# EAGLE design N2-D (EAGLE 7.6.0)
COMPANY: ADAFRUIT INDUSTRIES; DRAWN: KTOWN; REV: B
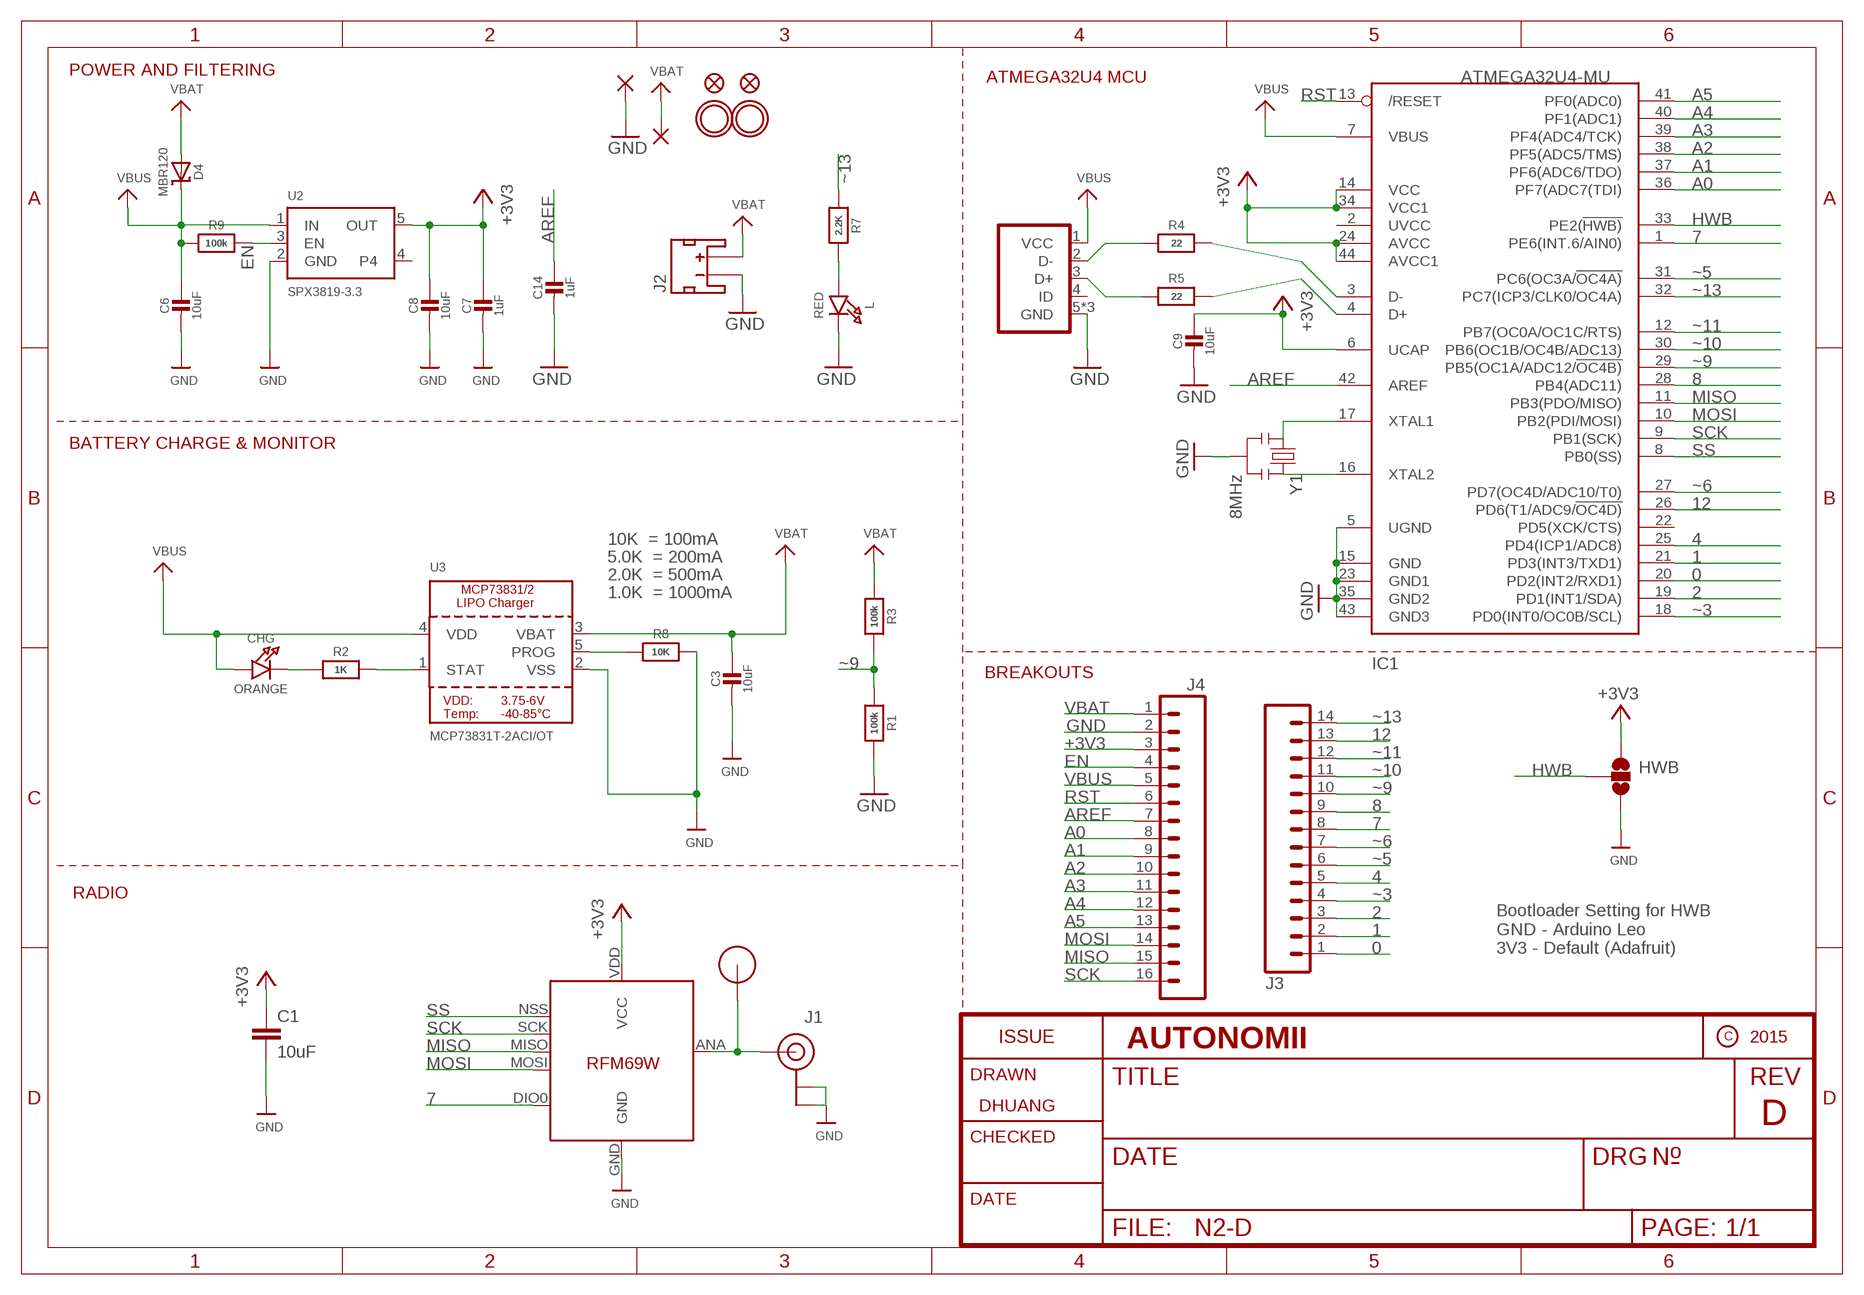
[diagram p0: schematic, sheet 1]
FRAME1 (FRAME_A4): COMPANY: AUTONOMII; DRAWN: DHUANG; REV: D

## Parts
C1  10uF  CAP0603-CAP  [0603-CAP]
C3  10uF  CAP_CERAMIC0805-NOOUTLINE  [0805-NO]
C6  10uF  CAP_CERAMIC0805-NOOUTLINE  [0805-NO]
C7  1uF  CAP_CERAMIC0603_NO  [0603-NO]
C8  10uF  CAP_CERAMIC0805-NOOUTLINE  [0805-NO]
C9  10uF  CAP_CERAMIC0805-NOOUTLINE  [0805-NO]
C14  1uF  CAP_CERAMIC0603_NO  [0603-NO]
CHG  ORANGE  LED0805_NOOUTLINE  [CHIPLED_0805_NOOUTLINE]
D4  MBR120  DIODE-SCHOTTKYSOD-123  [SOD-123]
HWB  SOLDERJUMPER_2WAYPASTE1&2  [SJ_3_PASTE1&2]
IC1  ATMEGA32U4-MU  [TQFN44_7MM]
J1  U.FL  [U.FL]
J2  JST_2MM_MALE  [JST-2-SMD]
J3  M14STACKING_BIG  [1X14_STACKING_BIG]
J4  M16STACKING_BIG  [1X16_STACKING_BIG]
L  RED  LED0805_NOOUTLINE  [CHIPLED_0805_NOOUTLINE]
PAD1  1,6/0,9  [1,6/0,9]
PAD2  1,6/0,9  [1,6/0,9]
R1  100k  RESISTOR_0603_NOOUT  [0603-NO]
R2  1K  RESISTOR_0603_NOOUT  [0603-NO]
R3  100k  RESISTOR_0603_NOOUT  [0603-NO]
R4  22  RESISTOR_0603_NOOUT  [0603-NO]
R5  22  RESISTOR_0603_NOOUT  [0603-NO]
R7  2.2K  RESISTOR_0603_NOOUT  [0603-NO]
R8  10K  RESISTOR_0603_NOOUT  [0603-NO]
R9  100k  RESISTOR_0603_NOOUT  [0603-NO]
U2  SPX3819-3.3  VREG_SOT23-5  [SOT23-5]
U3  MCP73831T-2ACI/OT  MCP73831/2  [SOT23-5]
U$7  RFM12B_ANTENNA  [RFM12B-ANTENNA]
U$10  RFM69  [RFM69W-MINPADS]
U$31  MOUNTINGHOLE2.5  [MOUNTINGHOLE_2.5_PLATED]
U$32  MOUNTINGHOLE2.5  [MOUNTINGHOLE_2.5_PLATED]
U$34  FIDUCIAL""  [FIDUCIAL_1MM]
U$35  FIDUCIAL""  [FIDUCIAL_1MM]
USB  USB-RECEPTABLE  [FCI-10103594-0001LF]
Y1  8MHz  RESONATORSMD  [RESONATOR-SMD]

## Nets
0: IC1.20(PD2(INT2/RXD1)) J3.1
1: IC1.21(PD3(INT3/TXD1)) J3.2
2: IC1.19(PD1(INT1/SDA)) J3.3
4: IC1.25(PD4(ICP1/ADC8)) J3.5
7: IC1.1(PE6(INT.6/AIN0)) J3.8 U$10.DIO0
8: IC1.28(PB4(ADC11)) J3.9
12: IC1.26(PD6(T1/ADC9/!OC4D)) J3.13
+3V3: C1.1 C7.1 C8.1 C9.1 HWB.1 IC1.6(UCAP) IC1.14(VCC) IC1.24(AVCC) IC1.34(VCC1) IC1.44(AVCC1) J4.3 U2.5(OUT) U$10.VDD(VCC)
A0: IC1.36(PF7(ADC7(TDI)) J4.8
A1: IC1.37(PF6(ADC6/TDO)) J4.9
A2: IC1.38(PF5(ADC5/TMS)) J4.10
A3: IC1.39(PF4(ADC4/TCK)) J4.11
A4: IC1.40(PF1(ADC1)) J4.12
A5: IC1.41(PF0(ADC0)) J4.13
ANT: J1.P$3(SIGNAL) U$7.P$1 U$10.ANA(ANT)
AREF: C14.1 IC1.42(AREF) J4.7
D+: IC1.4(D+) R5.2
D++: R5.1 USB.3(D+)
D-: IC1.3(D-) R4.2
D--: R4.1 USB.2(D-)
EN: J4.4 R9.2 U2.3(EN)
GND: C1.2 C3.2 C6.2 C7.2 C8.2 C9.2 C14.2 HWB.3 IC1.5(UGND) IC1.15(GND) IC1.23(GND1) IC1.35(GND2) IC1.43(GND3) J1.P$1(GND) J1.P$2(GND) J2.1(-) J4.2 L.C PAD2.1(P) R1.2 R8.2 U2.2(GND) U3.2(VSS) U$10.GND USB.5(GND) USB.P$3(GND) USB.P$4(GND) Y1.2
HWB: HWB.2 IC1.33(PE2(!HWB))
MISO: IC1.11(PB3(PDO/MISO)) J4.15 U$10.MISO
MOSI: IC1.10(PB2(PDI/MOSI)) J4.14 U$10.MOSI
N$1: CHG.C R2.1
N$2: L.A R7.2
N$3: R2.2 U3.1(STAT)
N$4: R8.1 U3.5(PROG)
N$11: IC1.16(XTAL2) Y1.3
N$12: IC1.17(XTAL1) Y1.1
RST: IC1.13(/RESET) J4.6
SCK: IC1.9(PB1(SCK)) J4.16 U$10.SCK
SS: IC1.8(PB0(SS)) U$10.NSS(SEL)
VBAT: C3.1 D4.A J2.2(+) J4.1 PAD1.1(P) R3.1 U3.3(VBAT)
VBUS: C6.1 CHG.A D4.C IC1.7(VBUS) J4.5 R9.1 U2.1(IN) U3.4(VDD) USB.1(VCC)
~3: IC1.18(PD0(INT0/OC0B/SCL)) J3.4
~5: IC1.31(PC6(OC3A/!OC4A)) J3.6
~6: IC1.27(PD7(OC4D/ADC10/T0)) J3.7
~9: IC1.29(PB5(OC1A/ADC12/!OC4B)) J3.10 R1.1 R3.2
~10: IC1.30(PB6(OC1B/OC4B/ADC13)) J3.11
~11: IC1.12(PB7(OC0A/OC1C/RTS)) J3.12
~13: IC1.32(PC7(ICP3/CLK0/OC4A)) J3.14 R7.1
Unconnected: IC1.2(UVCC) IC1.22(PD5(XCK/CTS)) J2.NC1(PAD1) J2.NC2(PAD2) U2.4 USB.4(ID)

## Notes on the sheet
- POWER AND FILTERING
- ATMEGA32U4 MCU
- BATTERY CHARGE & MONITOR
- 10K  = 100mA
- 5.0K  = 200mA
- 2.0K  = 500mA
- 1.0K  = 1000mA
- BREAKOUTS
- RADIO
- Bootloader Setting for HWB
  GND - Arduino Leo
  3V3 - Default (Adafruit)

## Library data of the parts
C1 = autonomii:CAP: Capacitor Standard 0603 ceramic capacitor, and 0.1" leaded capacitor.
C3 C6-C9 C14 = microbuilder:CAP_CERAMIC: Ceramic Capacitors For new designs, use the packages preceded by an '_' character since they are more reliable: The following footprints should be used on most boards: _0402 - Standard footprint for regular board layouts _0603 - Standard footprint for regular board layouts _0805 - Standard footprint for regular board layouts _1206 - Standard footprint for regular board layouts For extremely tight-pitch boards where space is at a premium, the following 'micro-pitch' footprints can be used (smaller pads, no silkscreen outline, etc.): _0402MP - Micro-pitch footprint for very dense/compact boards _0603MP - Micro-pitch footprint for very dense/compact boards _0805MP - Micro-pitch footprint for very dense/compact boards _1206MP - Micro-pitch footprint for very dense/compact boards
CHG L = microbuilder:LED: LED 0603 - 0603 Surface Mount Package 2mA: Green LED - Low Power (3.9mcd, 2ma, 1.7Vf) - Digikey: 475-2709-2-ND Orange LED - Low Power (9.8mcd, 2ma, 1.8Vf) - Digikey: 475-1194-2-ND Red LED - Low Power (5mcd, 2ma, 1.8Vf) - Digikey: 475-1195-2-ND Yellow LED - Low Power (7mcd, 2ma, 1.8Vf) - Digikey: 475-1196-2-ND 5mA: Blue LED - Low Power (17mcd, 5ma, 2.9Vf) - Digikey: LNJ937W8CRACT-ND 0805 - 0805 Surface Mount Package 2mA: Red LED (8.8mcd, 2mA, 1.8Vf, Clear) - Low Power [Digikey: 475-2510-1-ND] Green LED (5mcd, 2mA, 1.8Vf, Clear) - Low Power [Digikey: 475-2730-1-ND] Yellow LED (11.3mcd, 2mA, 1.8Vf, Clear) - Low Power [Digikey: 475-2555-1-ND] 20mA: Red LED (104mcd, 20mA, Diffused) - LS R976 [Digikey: 475-1278-6-ND] Red LED (12mcd, 20mA, 2.0Vf, Clear) - APT2012EC [Digikey: 754-1128-1-ND] Green LED (15mcd, 20mA, 2.2Vf, Clear) - APT2012GC [Digikey: 754-1131-1-ND] Orange LED (160mcd, 20mA, 2.1Vf, Clear) - APT2012SECK [Digikey: 754-1130-1-ND] 1206 - 1206 Surface Mount Package Green LED (26mcd, 20mA, Diffused) - LG N971 [Digikey: 475-1407-6-ND] Red LED (15mcd, 20mA, Diffused) - LH N974 [Digikey: 475-1416-6-ND] Cree - Cree High-Power Surface Mount LEDs XPEBWT-L1-0000-00D50 - White 111lm 350mA 2.9Vf 6200K 110° XTEAWT-00-0000-00000LEE3 - White 114lm 350mA 2.85Vf 5000K 115° Everlight - Everlight 45-21 Series Surface Mount LEDs 45-21/QK2C-B2832AC2CB2/2T - Warm White 2000mcd 20mA 3.25Vf 3050K 120° 45-21/LK2C-B38452C4CB2/2T - Nuetral White 2000mcd 20mA 3.25Vf 4150K 120° 45-21/LK2C-B50634C6CB2/2T - Cold White 2200mcd 20mA 3.25Vf 5650K 120° PLCC2 Reverse Mount LS T77K-J1L2-1-0-2-R18-Z - Red 11.25mcd 2mA 1.8Vf 630nm 120° LO T77K-L1M2-24-Z - Orange 19.6mcd 2mA 1.8Vf 606nm 120° LY T77K-K2M1-26-Z - Yellow 15.7mcd 2mA 1.8Vf 587nm 120°
D4 = microbuilder:DIODE-SCHOTTKY
HWB = autonomii:SOLDERJUMPER_2WAY: Solder Jumper 2 way solder jumper
IC1 = microbuilder:ATMEGA32U4: http://www.ladyada.net/library/eagle
J1 = SparkFun-Connectors:U.FL: SMD antenna connector- WRL-09144; PROD_ID: CONN-09193
J2 = autonomii:JST_2MM_MALE: Mates to single-cell LiPo batteries. CONN-08352; PROD_ID: CONN-08352
J3 = autonomii:M14: Header 14 Standard 14-pin 0.1" header. Use with straight break away headers (SKU : PRT-00116), right angle break away headers (PRT-00553), swiss pins (PRT-00743), machine pins (PRT-00117), and female headers (PRT-00115).
J4 = autonomii:M16: 1x16 .1" header
PAD1 PAD2 = wirepad:1,6/0,9: THROUGH-HOLE PAD
R1-R5 R7-R9 = microbuilder:RESISTOR: Resistors For new designs, use the packages preceded by an '_' character since they are more reliable: The following footprints should be used on most boards: _0402 - Standard footprint for regular board layouts _0603 - Standard footprint for regular board layouts _0805 - Standard footprint for regular board layouts _1206 - Standard footprint for regular board layouts For extremely tight-pitch boards where space is at a premium, the following 'micro-pitch' footprints can be used (smaller pads, no silkscreen outline, etc.): _0402MP - Micro-pitch footprint for very dense/compact boards _0603MP - Micro-pitch footprint for very dense/compact boards _0805MP - Micro-pitch footprint for very dense/compact boards _1206MP - Micro-pitch footprint for very dense/compact boards
U2 = microbuilder:VREG_SOT23-5: SOT23-5 Fixed Voltage Regulators Part Current Out V Out V In V Dropout θJA (°C/W) TJ (°C) Digikey Part No. ADP121 150mA 3.3V 3.4-5.5V 0.09V @ 150mA -- -- ADP121-AUJZ33R7CT-ND ADP121 150mA 3.0V 3.1-5.5V 0.09V @ 150mA -- -- ADP121-AUJZ30R7CT-ND ADP122 300mA 3.3V 3.4-5.5V 0.085V @ 300mA -- -- ADP122AUJZ-3.3-R7CT-ND ADP1712 300mA 3.3V 3.5-5.5V 0.17V @ 300mA -- -- ADP1712AUJZ-3.3-R7TR-ND AP7311 (Low Cost) 150mA 3.3V 3.5-6V 0.15V @ 150mA -- -- AP7311-33WG-7DICT-ND LD39015M18R 150mA 1.8V 1.9V-5.5V 0.08V @ 100mA -- -- 497-6977-1-ND LP2985A-33DBVR 150mA 3.3V 3.3-16V 0.28V @ 150mA 206 150 296-18479-1-ND MCP1824T-3302E/OT 300mA 3.3V 3.5V-6V 0.2V @ 300mA -- -- MCP1824T-3302E/OTCT-ND MIC5205-2.5YM5 TR 150mA 2.5V 2.7-16V 0.165V @ 150mA -- -- 576-1257-2-ND MIC5205-3.0YM5 TR 150mA 3.0V 3.2V-16V 0.165V @ 150mA -- -- 576-1258-2-ND MIC5205-3.3YM5 TR 150mA 3.3V 3.5V-16V 0.165V @ 150mA -- -- 576-1259-2-ND TPS780330220 150mA 3.3V+2.2V 3.6-5.5V 250mV Max -- -- 296-23332-1-ND TDA3663/N1,135 100mA 3.3V 3.5-45V 0.18V @ 50mA -- -- 568-5343-1-ND Max operating temp can be calculated using θJA, TJ (max junction temperature), and power in watts. Set the "Maximum Ambient Temperature" until it reaches TJ ("Max Junction Temperature"), which is the absolute limit for safe use of the regulator: Heat Sink Temperature Calculator <http://www.daycounter.com/Calculators/Heat-Sink-Temperature-Calculator.phtml> For example, With 12V source into a 3.3V LP2985 and a 30mA load, we are dissipating (12V-3.3V) * 0.03A = 0.261W. With a θJA of 206 °C/W, a TJ of 150°C, and 261mW we can safely use the chip without a heat sink up to 75°C (=147.1°C Junction Temperature).
U3 = microbuilder:MCP73831/2: MCP73831/2 LIPO Charger VDD: 3.75 - 6V Temp -40 - 85°C Programmable Charge Rate: 15-500mA NOTE: STAT is a tri-state logic output on the MCP73831 and an open-drain output on the MCP73832. SOT23-5 with 4.2V output and tri-state logic on STAT = MCP73831T-2ACI/OT
U$7 = LowPowerLab:RFM12B_ANTENNA
U$10 = LowPowerLab:RFM69
U$31 U$32 = microbuilder:MOUNTINGHOLE: Mounting Hole For #2 screws (0.086"/2.18mm width, 0.094"/2.4mm hole) use 2.5mm; BOM: EXCLUDE
U$34 U$35 = microbuilder:FIDUCIAL: Fiducial Alignment Points Various fiducial points for machine vision alignment.; BOM: EXCLUDE
USB = autonomii:USB-RECEPTABLE: USB Receptable
Y1 = SparkFun:RESONATOR: Resonator Small SMD resonator. This is the itty bitty 10/20MHz resonators with built in caps. CSTCE10M0G55 and CSTCE20M0V53. Footprint has been reviewed closely but hasn't been tested yet.

## Net classes
1 power: width 0.381 mm, clearance 0.254 mm

## Board
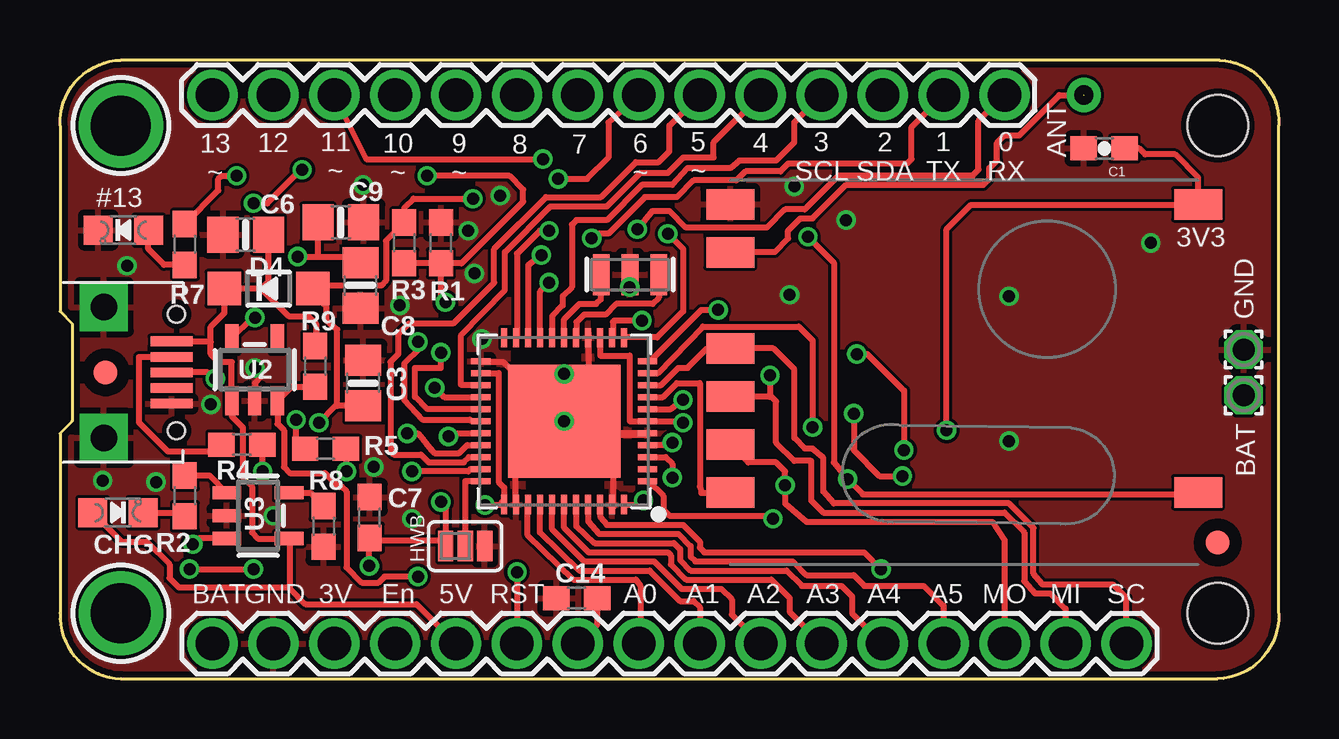
[diagram p1: board, top side]
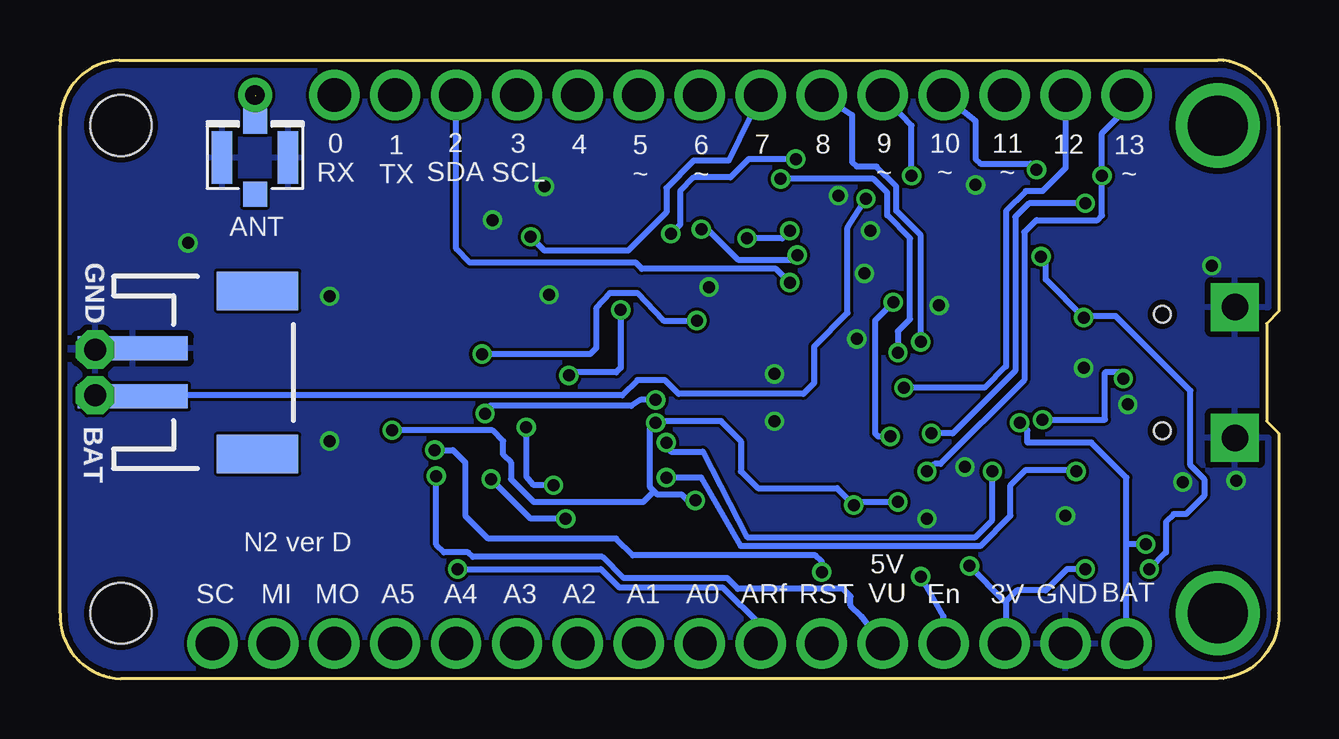
[diagram p2: board, bottom side, seen from below]

Size 50.8 x 25.78 mm. Coordinates in mm from the lower left corner, seen from the top.
Outline: 2.54,0 48.26,0 arc90 50.8,2.73 50.8,23.05 arc90 48.32,25.78 2.54,25.78 arc90 0,23.05 0,15.3 0.51,14.8 0.51,10.73 0,10.22 0,2.73 arc90 2.54,0
Copper layers (1*16): Top 0.035mm / dielectric 1.5mm / Bottom 0.035mm
Design rules "dirt_cheap_dirty_boards.v1": minimum track width 5mil, minimum drill 12mil, track to track 5mil, track to pad 5mil, pad to pad 5mil, via to via 5mil, smd to smd 0mil, copper to edge 10mil, drill to drill 10mil, minimum pad ring 10mil, minimum via ring 6mil, stop-mask expansion 2mil, vias tented up to drill 25mil, thermal gap 10mil
Holes 2.54 mm at 48.26,23.05 48.26,2.73
tRestrict: area 19.4,7.8 to 22.7,8.2; area 18.8,13.3 to 21.7,13.7; area 23.5,8.1 to 23.9,10

### Footprints (pad centres in the part's own frame; a part is rotated, then mirrored left to right if it is on the bottom)
0603-CAP = smd 1.1 x 1: 1 -0.85,0; 2 0.85,0
0805-NO = smd 1.3 x 1.5: 1 -0.95,0; 2 0.95,0
0603-NO = smd 1.1 x 1: 1 -0.85,0; 2 0.85,0
CHIPLED_0805_NOOUTLINE = smd 1.2 x 1.2: A 0,-1.05; C 0,1.05
SOD-123 = smd 1.4 x 1.4: A 1.85,0; C -1.85,0
SJ_3_PASTE1&2 = smd 0.635 x 1.27: 1 -0.813,0; 2 0,0; 3 0.813,0
TQFN44_7MM = smd 0.25 x 0.8: 1 -2.5,-3.475; 2 -2,-3.475; 3 -1.5,-3.475; 4 -1,-3.475; 5 -0.5,-3.475; 6 0,-3.475; 7 0.5,-3.475; 8 1,-3.475; 9 1.5,-3.475; 10 2,-3.475; 11 2.5,-3.475; 23 2.5,3.475; 24 2,3.475; 25 1.5,3.475; 26 1,3.475; 27 0.5,3.475; 28 0,3.475; 29 -0.5,3.475; 30 -1,3.475; 31 -1.5,3.475; 32 -2,3.475; 33 -2.5,3.475 | smd 0.8 x 0.25: 12 3.475,-2.5; 13 3.475,-2; 14 3.475,-1.5; 15 3.475,-1; 16 3.475,-0.5; 17 3.475,0; 18 3.475,0.5; 19 3.475,1; 20 3.475,1.5; 21 3.475,2; 22 3.475,2.5; 34 -3.475,2.5; 35 -3.475,2; 36 -3.475,1.5; 37 -3.475,1; 38 -3.475,0.5; 39 -3.475,0; 40 -3.475,-0.5; 41 -3.475,-1; 42 -3.475,-1.5; 43 -3.475,-2; 44 -3.475,-2.5 | smd 4.7 x 4.7: THERMAL 0,0
U.FL = smd 2.2 x 0.85: P$1 0,1.375; P$2 0,-1.375 | smd 1.05 x 1: P$3 1.525,0; P$4 -1.525,0
JST-2-SMD = smd 1 x 4.6: 1 -1,-3.7; 2 1,-3.7 | smd 1.6 x 3.4: NC1 -3.4,1.5; NC2 3.4,1.5
1X14_STACKING_BIG = drill 1.4 pad 1.88: 1 -16.51,0; 2 -13.97,0; 3 -11.43,0; 4 -8.89,0; 5 -6.35,0; 6 -3.81,0; 7 -1.27,0; 8 1.27,0; 9 3.81,0; 10 6.35,0; 11 8.89,0; 12 11.43,0; 13 13.97,0; 14 16.51,0
1X16_STACKING_BIG = drill 1.4 pad 1.88: 1 -19.05,0; 2 -16.51,0; 3 -13.97,0; 4 -11.43,0; 5 -8.89,0; 6 -6.35,0; 7 -3.81,0; 8 -1.27,0; 9 1.27,0; 10 3.81,0; 11 6.35,0; 12 8.89,0; 13 11.43,0; 14 13.97,0; 15 16.51,0; 16 19.05,0
1,6/0,9 = drill 0.914 pad 1.6 octagon: 1 0,0
SOT23-5 = smd 0.55 x 1.2: 1 -0.95,-1.3; 2 0,-1.3; 3 0.95,-1.3; 4 0.95,1.3; 5 -0.95,1.3
RFM12B-ANTENNA = drill 0.8 pad 1.422: P$1 0,0
RFM69W-MINPADS = smd 2 x 1.27: ANA 8,-5; DIO0 -11.5,5; GND 8,-7; MISO 8,1; MOSI 8,3; NSS 8,5; SCK 8,-1; VDD -11.5,-7
MOUNTINGHOLE_2.5_PLATED = drill 2.5 pad 3.2: P$1 0,0
FIDUCIAL_1MM = smd 1 x 1: 1 0,0
FCI-10103594-0001LF = smd 0.4 x 1.75: 1 -1.3,4.525; 2 -0.65,4.525; 3 0,4.525; 4 0.65,4.525; 5 1.3,4.525 | drill 1.1 pad 2 square: P$3 -2.725,1.7; P$4 2.725,1.7 | hole 0.7: -2.425,4.73; 2.425,4.73
RESONATOR-SMD = smd 0.7 x 1.7: 1 -1.2,0; 2 0,0; 3 1.2,0

### Placement (x,y rotation side)
C1  43.52,22.1 180 top
C3  12.64,12.32 90 top
C6  7.74,18.5 180 top
C7  12.91,6.72 90 top
C8  12.52,16.39 270 top
C9  11.71,19.02 0 top
C14  21.54,3.36 180 top
CHG  2.41,6.92 270 top
D4  8.7,16.26 0 top
HWB  16.89,5.52 0 top
IC1  21.02,10.73 90 top
J1  42.67,21.72 90 bottom
J2  44.07,12.76 270 bottom
J3  22.86,24.32 180 top
J4  25.4,1.46 0 top
L  2.65,18.69 90 top
PAD1  49.34,11.81 0 top
PAD2  49.34,13.72 270 top
R1  15.88,18.16 90 top
R2  5.21,7.62 90 top
R3  14.35,18.16 270 top
R4  7.58,9.76 0 top
R5  11.07,9.58 0 top
R7  5.21,18.1 270 top
R8  10.99,6.35 270 top
R9  10.64,13.02 270 top
U2  8.12,12.88 0 top
U3  8.26,6.79 270 top
U$7  42.67,24.32 0 top
U$10  35.94,12.76 180 top
U$31  2.54,23.05 270 top
U$32  2.54,2.73 270 top
U$34  1.91,12.76 270 top
U$35  48.26,5.68 270 top
USB  0.13,12.76 270 top
Y1  23.76,16.84 0 top

### Tracks (layer width: path | path; a pad name or v marks a point on that pad's centre or on a via)
0  (via drill 0.5)
  Top 0.254: v24.07,18.73 24.7,19.49 25.4,19.49 26.1,18.8 29.46,18.8 30.23,19.56 31.05,19.56 32.45,20.96 38.04,20.96 38.29,21.21 38.29,23.24 J3.1 | v20.07,17.65 19.52,17.23 IC1.20
  Bottom 0.254: v24.07,18.73 23.81,18.73 22.54,17.46 20.26,17.46 v20.07,17.65
1  (via drill 0.5)
  Top 0.254: v22.16,18.35 22.35,18.54 22.86,18.54 24.38,20.07 25.72,20.07 26.42,20.76 28.19,20.76 28.57,21.15 30.04,21.15 30.35,21.46 35.31,21.46 35.5,21.65 35.5,22.99 J3.2 | IC1.21 19.05,14.24 19.05,17.72 20,18.67 v20.38,18.67
  Bottom 0.254: v20.38,18.67 20.7,18.35 v22.16,18.35
2  (via drill 0.5)
  Top 0.254: 20,14.22 IC1.19 20.02,16.14 v20.38,16.51
  Bottom 0.254: v20.38,16.51 20.95,17.08 26.54,17.08 26.8,17.34 33.72,17.34 34.29,17.91 J3.3
4
  Top 0.254: IC1.25 17.52,12.26 16.7,12.26 16.7,14.29 18.54,16.19 18.54,17.78 20.45,19.68 22.8,19.68 24.19,21.08 25.34,21.08 25.97,21.72 27.24,21.72 27.24,22.35 J3.5
7  (via drill 0.5)
  Top 0.254: IC1.1 24.54,8.23 25.15,7.62 25.15,7.05 25.4,6.79 29.59,6.79 v29.72,6.67 | v31.18,18.41 32.26,17.34 32.26,9.02 v32.83,8.32 33.47,7.68 46.61,7.68 46.69,7.76 U$10.DIO0
  Bottom 0.254: J3.8 22.92,21.59 24.38,21.59 25.53,20.45 25.53,19.43 27.11,17.84 30.61,17.84 v31.18,18.41 | v29.72,6.67 31.18,6.67 v32.83,8.32
8  (via drill 0.5)
  Top 0.254: v14.92,14.03 14.99,13.78 14.35,13.14 14.35,11.62 15.11,10.79 17.08,10.79 17.21,10.73 IC1.28
  Bottom 0.254: J3.9 17.78,23.5 17.78,21.53 17.59,21.34 16.76,21.34 15.94,20.51 15.94,19.49 14.92,18.48 v14.92,14.03
12  (via drill 0.5)
  Top 0.254: v15.62,12.13 16.02,11.73 IC1.26
  Bottom 0.254: J3.13 8.89,21.27 9.84,20.32 10.54,20.32 11.37,19.49 11.37,13.02 12.26,12.13 v15.62,12.13
+3V3  (via drill 0.5)
  Top 0.254: IC1.14 22.52,13.46 23.75,13.46 23.75,10.73 IC1.6 25.91,10.73 v25.97,10.67 | IC1.44 24.15,7.26 v24.32,7.43 | IC1.24 18.29,12.73 18.29,8.19 18.52,7.96 IC1.34 | 7.26,14.18 U2.5 8.04,15.05 v8.13,15.05 | v9.91,17.59 10.76,17.59 | 10.76,17.59 C9.1 | 10.76,17.59 12.59,17.59 C8.1 | v5.4,4.57 v8.06,4.57 | v36.96,10.35 36.96,18.73 37.97,19.75 47.43,19.75 U$10.VDD 47.44,20.89 46.48,21.84 45.24,21.84 44.98,22.1 C1.1 | v12.89,4.7 12.89,5.85 C7.1 13,5.78 15.82,5.78 HWB.1 16.08,7.16 v15.88,7.37 | 18.41,7.37 IC1.34 | v17.72,7.24 17.73,7.26 IC1.34
  Bottom 0.254: 26.04,7.81 26.23,8 26.23,10.41 v25.97,10.67 25.91,10.73 23.24,10.73 22.42,9.91 22.42,8.64 21.72,7.94 18.41,7.94 17.84,7.37 | 26.04,7.81 25.91,7.68 24.89,7.68 24.64,7.43 v24.32,7.43 | 26.04,7.81 26.48,7.37 31.05,7.37 32,8.32 32,9.02 32.32,9.33 32.32,9.91 32.77,10.35 v36.96,10.35 | v9.91,17.59 9.72,17.34 9.72,16.64 v8.13,15.05 8.06,15.11 6.79,15.11 3.68,12 3.68,8.89 3.11,8.32 3.11,7.62 3.87,6.86 4.38,6.86 4.7,6.54 4.7,5.27 v5.4,4.57 | v8.06,4.57 8.83,4.57 9.72,3.68 10.92,3.68 11.37,3.24 | 11.37,3.24 11.37,1.52 J4.3 | v12.89,4.7 11.43,3.24 11.37,3.24 | 17.84,7.37 v15.88,7.37 | 17.84,7.37 v17.72,7.24
A0
  Top 0.254: IC1.36 19.49,7.23 19.49,5.97 21.4,4.13 24,4.13 24.19,3.87 24.19,1.52 J4.8
A1
  Top 0.254: IC1.37 20,7.24 20,6.1 21.65,4.51 24.57,4.51 25.84,3.24 26.42,3.24 26.67,2.98 J4.9
A2
  Top 0.254: IC1.38 20.51,7.25 20.51,6.22 21.84,4.89 24.77,4.89 25.91,3.75 27.56,3.75 28,3.3 28,2.67 J4.10
A3
  Top 0.254: IC1.39 21.02,6.29 22.04,5.27 25.34,5.27 25.46,5.14 25.46,4.76 26.1,4.13 29.65,4.13 30.42,3.37 30.42,2.79 J4.11
A4
  Top 0.254: IC1.40 21.53,7.25 21.53,6.35 22.29,5.65 25.59,5.65 25.84,5.4 25.84,4.95 26.29,4.51 30.29,4.51 30.92,3.87 32.58,3.87 33.02,3.43 33.02,2.73 J4.12
A5
  Top 0.254: IC1.41 22.02,6.56 22.48,6.03 25.78,6.03 26.29,5.52 26.29,5.08 26.48,4.89 30.54,4.89 31.11,4.32 33.08,4.32 33.53,3.87 36.01,3.87 36.83,3.05 J4.13
ANT  (1 unrouted)
  Top 0.254: U$10.ANA 27.96,17.78 29.78,17.78 30.35,18.35 30.35,18.67 30.86,19.18 31.37,19.18 32.77,20.57 38.48,20.57 38.73,20.83 38.73,21.27 39.05,21.59 39.05,22.33 39.37,22.64 39.98,22.64 41.66,24.32 U$7.P$1
  Bottom 0.254: 42.65,24.3 42.65,23.27 J1.P$3
AREF  (via drill 0.5)
  Top 0.254: IC1.42 22.52,6.75 22.8,6.41 25.97,6.41 26.67,5.71 26.67,5.46 26.86,5.27 33.53,5.27 v34.23,4.57 | C14.1 22.39,2.26 J4.7
  Bottom 0.254: v34.23,4.57 28.26,4.57 27.5,3.81 23.18,3.81 21.59,2.22 J4.7
D+  (via drill 0.5)
  Top 0.254: v25.53,9.84 25.42,9.73 IC1.4 | R5.2 11.92,8.65 v11.94,8.64
  Bottom 0.254: v25.53,9.84 25.34,9.65 25.34,9.46 24,9.46 22.16,5.91 12.64,5.91 11.94,6.6 v11.94,8.64
D++  (via drill 0.5)
  Top 0.254: v6.48,12.51 6.16,12.76 USB.3 | R5.1 9.84,10.02 v9.84,10.79
  Bottom 0.254: v9.84,10.79 7.24,10.79 7.24,12.76 6.54,12.76 v6.48,12.51
D-  (via drill 0.5)
  Top 0.254: IC1.3 25.25,9.23 25.53,8.95 v25.53,8.38 | v8.45,8.64 8.45,9.75 R4.2
  Bottom 0.254: v25.53,8.38 24.07,8.38 22.42,5.52 12.45,5.52 11.18,6.79 11.18,8.06 10.54,8.7 8.51,8.7 v8.45,8.64
D--
  Top 0.254: 3.87,13.4 5.06,13.4 5.06,13.41 USB.2 3.32,13.41 3.3,13.4 3.3,10.67 4.51,9.46 6.44,9.46 R4.1 6.37,9.4
EN  (via drill 0.5)
  Top 0.254: R9.2 9.65,12.17 U2.3 9.06,10.62 9.34,10.35 9.34,8.83 9.59,8.57 11.05,8.57 11.62,8 11.75,8 11.94,7.81 11.94,4.64 12.57,4 13.27,4 13.53,4.25 v14.92,4.25
  Bottom 0.254: J4.4 13.97,2.6 v14.92,4.25
GND  (via drill 0.5)
  Top 0.254: v21.02,10.73 21.02,10.67 | 21.02,10.67 21.02,10.41 | 22.04,14.41 22.04,14.22 | 22.04,14.22 22.04,11.75 v21.02,10.73 | 22.8,10.16 24.45,10.16 24.51,10.22 | v21.02,10.73 20.95,10.73 | 23.05,7.24 23.05,8.7 v21.02,10.73 | 23.05,7.24 23.05,7.18 | 23.05,7.18 22.99,7.11 | 24.51,10.22 24.51,10.29 | 23.05,7.18 23.05,7.11 | IC1.43 23.03,7.26 23.05,7.24 | 18.99,7.22 IC1.35 | 18.99,7.18 18.99,7.22 | 18.99,7.22 18.99,8.7 v21.02,10.73 | 24.5,10.22 21.53,10.22 v21.02,10.73 | 24.51,10.22 24.5,10.22 | 24.5,10.22 IC1.5 | IC1.23 17.57,13.23 17.59,13.21 | 8.38,12.57 8.13,12.32 U2.2 | 17.53,13.21 18.48,13.21 21.02,10.67 | IC1.15 22.04,14.22 | v21.02,12.7 v21.02,10.73
  other vias: 39.56,9.91 32.77,19.11 8.89,6.79 17.59,14.16 14.16,15.56 14.67,6.67 13.08,8.83 8.13,12.95 4,8.19 2.79,17.21 6.29,11.43 12.64,20.57 17.02,18.67 39.56,15.94 45.47,18.16 30.42,16 30.61,20.51 23.75,16.32 18.35,20.13 17.27,16.89 1.78,8.26
  pour Top: -0.76,26.35 -0.76,-0.44 51.5,-0.44 51.69,26.23
  pour Bottom: -0.51,-0.06 51.18,-0.13 51.31,25.91 -0.38,25.97
HWB
  Top 0.254: IC1.33 16.89,8.23 HWB.2
MISO  (via drill 0.5)
  Top 0.254: 29.59,11.75 29.65,11.75 29.84,11.56 29.84,9.84 30.61,9.08 31.3,9.08 31.3,7.43 31.81,6.92 39.37,6.92 40.2,6.1 40.2,4.06 40.64,3.56 41.27,3.56 41.91,2.92 J4.15 | 29.59,11.75 27.96,11.75 U$10.MISO | v29.59,12.64 29.59,11.75 | IC1.11 24.6,13.23 26.73,15.37 v27.43,15.37
  Bottom 0.254: v27.43,15.37 27.43,12.95 27.62,12.76 29.46,12.76 v29.59,12.64
MOSI  (via drill 0.5)
  Top 0.254: J4.14 39.37,5.78 38.86,6.54 31.11,6.54 30.23,7.3 v30.23,8.06 30.23,8.64 29.84,9.02 28.69,9.02 U$10.MOSI | IC1.10 24.92,12.73 26.8,14.67 30.8,14.67 31.37,14.1 v31.37,10.48
  Bottom 0.254: v31.37,10.48 31.37,8.45 31.05,8.06 v30.23,8.06
N$1
  Top 0.254: CHG.C 5.06,6.92 R2.1
N$2
  Top 0.254: R7.2 4.34,17.25 3.68,17.91 3.68,18.68 L.A
N$3
  Top 0.254: R2.2 6.23,8.47 U3.1
N$4
  Top 0.254: U3.5 10.44,7.74 R8.1
N$11
  Top 0.254: Y1.3 24.96,15.88 24.7,15.62 23.18,15.62 22.73,15.18 21.84,15.18 21.53,14.86 IC1.16
N$12
  Top 0.254: IC1.17 21.02,14.99 21.65,15.62 22.35,15.62 22.54,15.81 22.54,16.82 Y1.1
RST  (via drill 0.5)
  Top 0.254: v24.26,14.92 23.11,14.92 23.05,14.86 23.05,14.24 IC1.13 | v19.05,4.45 J4.6 | v33.21,13.53 33.66,13.53 35.18,12 v35.18,9.53
  Bottom 0.254: v24.26,14.92 25.65,14.92 26.73,16.07 27.88,16.07 28.45,15.43 28.45,13.78 28.7,13.53 v33.21,13.53 | v35.18,9.53 34.42,9.53 33.91,9.02 33.91,6.79 32.96,5.84 27.62,5.84 26.92,5.14 19.3,5.14 19.05,4.89 v19.05,4.45
SCK
  Top 0.254: J4.16 44.45,3.37 43.88,3.94 40.96,3.94 40.58,4.38 40.58,6.29 39.56,7.3 32.26,7.3 31.81,7.81 31.81,9.21 31.37,9.59 31.05,9.59 30.61,10.03 30.61,12.89 29.73,13.76 U$10.SCK 26.97,13.76 26.16,12.95 25.78,12.95 25.06,12.23 IC1.9
SS
  Top 0.254: IC1.8 25.13,11.73 25.72,12.32 26.67,12.32 26.67,8 26.73,7.75 27.92,7.75 U$10.NSS
VBAT  (via drill 0.5)
  Top 0.254: C3.1 11.56,11.37 | 11.56,11.37 11.56,14.54 11.11,14.92 11.11,15.49 10.55,16.06 D4.A | 11.56,11.37 11.5,11.37 v10.79,10.67 | D4.A 10.74,16.07 arc-90 D4.A | v17.21,20 14.73,20 14.35,19.62 R3.1 13.59,18.25 13.59,16.57 13.4,16.38 10.68,16.38 D4.A | U3.3 5.78,5.84 v5.54,5.6
  Bottom 0.254: v10.79,10.67 10.48,10.35 10.48,9.84 7.81,9.84 6.35,8.38 6.35,5.6 | v17.21,20 17.97,18.8 17.97,15.24 19.37,13.84 19.37,12.32 19.81,11.87 25.02,11.87 25.59,12.45 26.73,12.45 27.37,11.81 PAD1.1 49.17,11.81 J2.2 | J4.1 6.35,5.6 | v5.54,5.6 6.35,5.6
VBUS  (via drill 0.5)
  Top 0.254: IC1.7 25.46,11.23 v25.97,11.62 | v33.08,11.05 33.08,9.53 34.16,8.45 v35.12,8.45 | 8.38,16.26 D4.C | D4.C 6.85,15.85 | 8.38,16.26 9.53,15.11 10.35,15.11 10.67,14.8 10.67,13.89 R9.1 | 9.59,5.88 U3.4 | 9.59,3.75 9.59,5.81 U3.4 | U3.4 8.26,5.84 8,6.1 8,8 7.62,8.38 7.62,10.48 7.17,10.93 U2.1 7.17,13.21 6.6,13.21 6.29,13.53 6.29,14.03 | 8.38,16.26 8.69,16.57 C6.1 | 6.29,14.03 6.29,14.67 6.86,15.24 6.86,16.25 D4.C | USB.1 6.26,14.06 6.29,14.03 | CHG.A 2.57,5.71 3.62,5.71 4.57,4.76 4.57,4.19 4.95,3.81 9.53,3.81 9.59,3.75 | 9.59,3.75 10.22,3.11 14.86,3.11 J4.5
  Bottom 0.254: v25.97,11.62 26.61,11.62 26.99,11.37 32.89,11.37 v33.08,11.05 | J4.5 17.4,2.6 17.84,3.05 17.84,3.43 18.16,3.75 22.54,3.75 22.99,4.19 27.3,4.19 28.19,5.08 33.59,5.08 33.78,5.27 34.8,5.27 35.12,5.59 v35.12,8.45
~3
  Top 0.254: IC1.18 20.51,15.11 20.95,15.56 20.95,15.94 21.34,16.32 21.34,18.92 21.53,19.11 22.8,19.11 24.26,20.57 25.53,20.57 26.16,21.27 27.94,21.27 28.32,21.59 29.84,21.59 30.61,22.35 30.61,23.18 J3.4
~5
  Top 0.254: IC1.31 17.04,9.23 16.83,9.02 15.37,9.02 15.05,9.33 13.91,9.33 13.78,9.46 13.78,13.21 14.1,13.53 14.1,14.35 14.54,14.8 16.38,14.8 18.1,16.51 18.1,17.91 20.26,20.07 22.54,20.07 24,21.53 24.96,21.53 25.4,21.97 25.4,23.05 J3.6
~6  (via drill 0.5)
  Top 0.254: IC1.27 15.31,11.23 14.8,11.75 14.8,12.95 15.88,12.95 v15.88,13.59 | J3.7 22.86,23.18 22.86,21.72 21.97,20.83 v20.77,20.83
  Bottom 0.254: v20.77,20.83 16.89,20.83 16.32,20.26 16.32,19.3 15.37,18.35 15.37,14.99 15.88,14.48 v15.88,13.59
~9  (via drill 0.5)
  Top 0.254: v15.3,20.96 18.73,20.96 19.3,20.38 19.3,19.88 16.74,17.31 R1.1 | 16,17.18 R1.1 | v16.07,15.68 15.88,15.87 R1.1 | R1.1 R3.2 | v16.19,10.1 16.33,10.23 IC1.29
  Bottom 0.254: v15.3,20.96 15.3,23.05 J3.10 | v16.07,15.68 16.83,14.92 16.83,10.22 16.7,10.1 v16.19,10.1
~10  (via drill 0.5)
  Top 0.254: v10.1,21.21 10.03,21.21 8.64,19.81 v8.06,19.81 | v14.48,10.22 14.92,10.22 15.49,9.53 15.62,9.4 16.64,9.4 16.97,9.73 IC1.30
  Bottom 0.254: J3.11 12.64,23.24 12.64,21.65 12.45,21.46 10.35,21.46 v10.1,21.21 | v8.06,19.81 10.41,19.81 10.99,19.24 10.99,12.83 13.59,10.22 v14.48,10.22
~11  (via drill 0.5)
  Top 0.254: J3.12 12.76,21.65 v20.13,21.65 | v25.34,18.54 25.97,17.91 25.97,15.3 24.89,14.22 23.54,14.22 IC1.12
  Bottom 0.254: v20.13,21.65 22.1,21.65 22.86,20.89 24.38,20.89 24.96,20.32 24.96,18.92 v25.34,18.54
~13  (via drill 0.5)
  Top 0.254: IC1.32 17.11,8.73 17.02,8.64 v14.67,8.64 | R7.1 6.6,20.34 6.6,20.83 6.73,20.96 v7.37,20.96
  Bottom 0.254: v14.67,8.64 14.35,8.95 14.1,8.95 10.6,12.45 10.6,18.61 10.1,19.11 7.56,19.11 7.37,19.3 v7.37,20.96 7.37,21.08 7.37,22.73 6.35,23.75 J3.14

### Text on the board
tPlace: ANT | 13 / ~ | 12 | 11 / ~ | 10 / ~ | 9 / ~ | 8 | 7 | 6 / ~ | 5 / ~ | 4 | 3 / SCL | 2 / SDA | 1 / TX | 0 / RX | #13 | 3V3 | GND | BAT | BAT | GND | 3V | En | 5V | RST | A0 | A1 | A2 | A3 | A4 | A5 | MO | MI | SC
bPlace: 12 | 11 / ~ | 10 / ~ | 9 / ~ | 8 | 7 | 4 | 3 / SCL | 2 / SDA | 0 / RX | 13 / ~ | 6 / ~ | 5 / ~ | 1 / TX | ANT | GND | BAT | N2 ver D | 5V / VU | BAT | GND | 3V | En | RST | ARf | A0 | A1 | A2 | A3 | A4 | A5 | MO | MI | SC
Document: NOMII II | Hackable / Secure / Long Range / Wireless / Low Power / Rechargeable / / / / / DIY Kit | autonomii.com